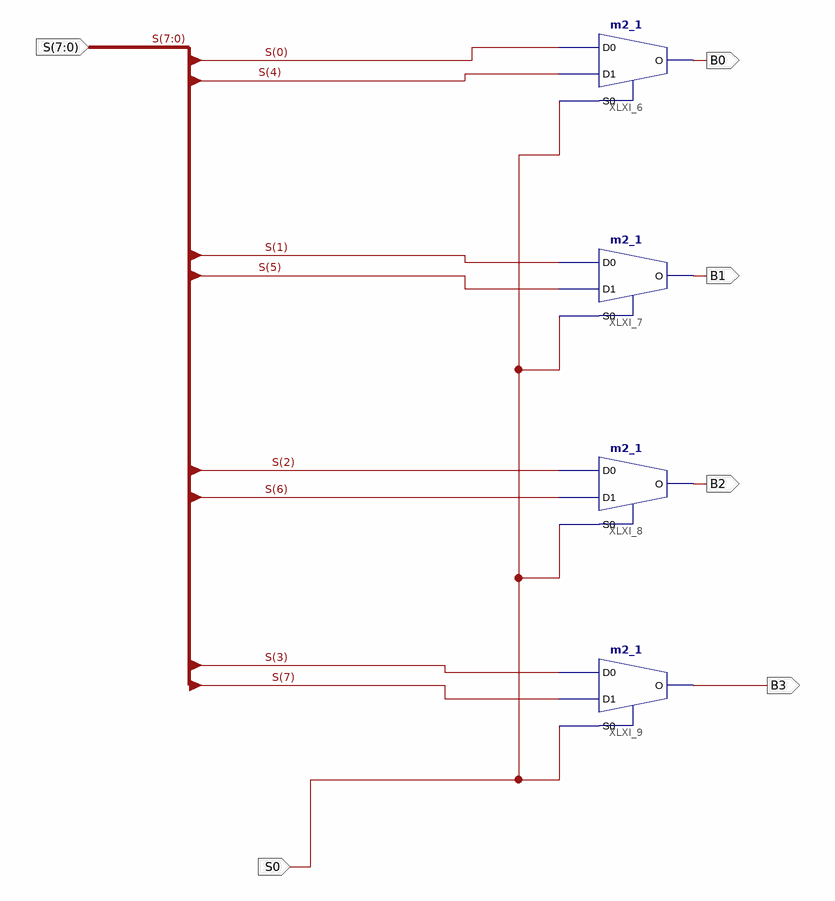
[diagram p0: schematic sheet 1]
// Xilinx ISE schematic MUX8_4.sch (spartan6) as structural Verilog: 4 symbols, 6 ports
module MUX8_4 (
  input  S0,
  input  [7:0] S,
  output B3,
  output B2,
  output B1,
  output B0
);

  m2_1 XLXI_6 (.D0(S[0]), .D1(S[4]), .S0(S0), .O(B0));
  m2_1 XLXI_7 (.D0(S[1]), .D1(S[5]), .S0(S0), .O(B1));
  m2_1 XLXI_8 (.D0(S[2]), .D1(S[6]), .S0(S0), .O(B2));
  m2_1 XLXI_9 (.D0(S[3]), .D1(S[7]), .S0(S0), .O(B3));
endmodule
